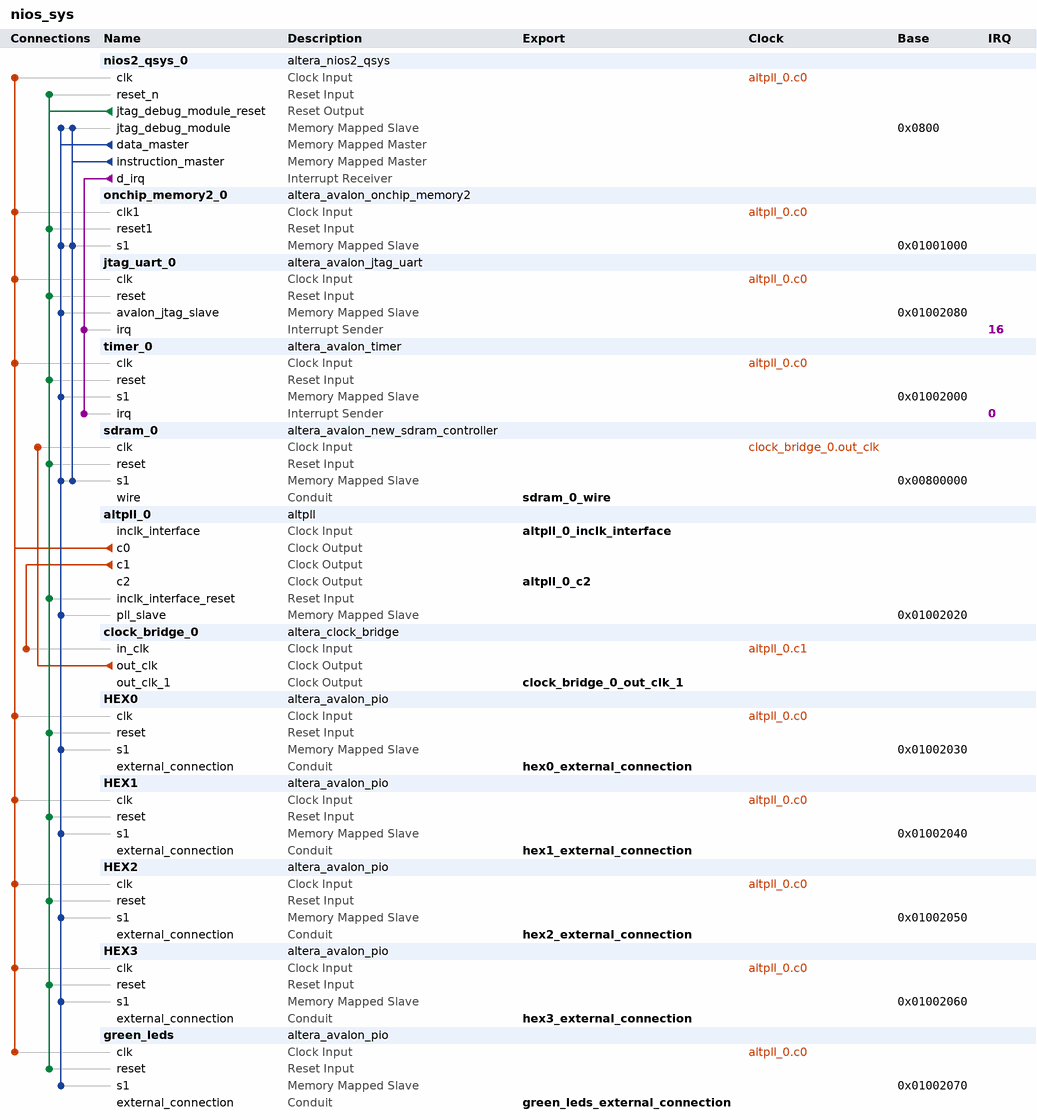
[diagram p0: system contents]
# Platform Designer (Qsys) system nios_sys, Cyclone II EP2C20F484C7
# Parameters at their usual value, and those the tool derives, are not listed.
package require -exact qsys 12.0
create_system nios_sys
set_project_property DEVICE_FAMILY {Cyclone II}
set_project_property DEVICE EP2C20F484C7

add_instance nios2_qsys_0 altera_nios2_qsys 12.0
set_instance_parameter_value nios2_qsys_0 resetSlave sdram_0.s1
set_instance_parameter_value nios2_qsys_0 exceptionSlave sdram_0.s1
set_instance_parameter_value nios2_qsys_0 breakSlave nios2_qsys_0.jtag_debug_module
set_instance_parameter_value nios2_qsys_0 impl Tiny
set_instance_parameter_value nios2_qsys_0 icache_size 4096

add_instance onchip_memory2_0 altera_avalon_onchip_memory2 12.0
set_instance_parameter_value onchip_memory2_0 dataWidth 32
set_instance_parameter_value onchip_memory2_0 dualPort false
set_instance_parameter_value onchip_memory2_0 initMemContent true
set_instance_parameter_value onchip_memory2_0 initializationFileName onchip_memory2_0
set_instance_parameter_value onchip_memory2_0 memorySize 4096

add_instance jtag_uart_0 altera_avalon_jtag_uart 12.0
set_instance_parameter_value jtag_uart_0 simInteractiveOptions INTERACTIVE_ASCII_OUTPUT

add_instance timer_0 altera_avalon_timer 12.0
set_instance_parameter_value timer_0 period 1
set_instance_parameter_value timer_0 periodUnits MSEC
set_instance_parameter_value timer_0 timerPreset CUSTOM

add_instance sdram_0 altera_avalon_new_sdram_controller 12.0
set_instance_parameter_value sdram_0 TAC 5.5
set_instance_parameter_value sdram_0 TRCD 20.0
set_instance_parameter_value sdram_0 TRP 20.0
set_instance_parameter_value sdram_0 casLatency 3
set_instance_parameter_value sdram_0 columnWidth 8
set_instance_parameter_value sdram_0 dataWidth 16
set_instance_parameter_value sdram_0 generateSimulationModel false
set_instance_parameter_value sdram_0 model custom
set_instance_parameter_value sdram_0 numberOfBanks 4
set_instance_parameter_value sdram_0 numberOfChipSelects 1
set_instance_parameter_value sdram_0 powerUpDelay 100.0
set_instance_parameter_value sdram_0 refreshPeriod 15.625
set_instance_parameter_value sdram_0 rowWidth 12

add_instance altpll_0 altpll 12.0
set_instance_parameter_value altpll_0 INCLK0_INPUT_FREQUENCY 20000
set_instance_parameter_value altpll_0 GATE_LOCK_SIGNAL YES
set_instance_parameter_value altpll_0 GATE_LOCK_COUNTER 25000
set_instance_parameter_value altpll_0 VALID_LOCK_MULTIPLIER 1
set_instance_parameter_value altpll_0 INVALID_LOCK_MULTIPLIER 5
set_instance_parameter_value altpll_0 CLK0_MULTIPLY_BY 1
set_instance_parameter_value altpll_0 CLK1_MULTIPLY_BY 1
set_instance_parameter_value altpll_0 CLK2_MULTIPLY_BY 1
set_instance_parameter_value altpll_0 CLK0_DIVIDE_BY 1
set_instance_parameter_value altpll_0 CLK1_DIVIDE_BY 1
set_instance_parameter_value altpll_0 CLK2_DIVIDE_BY 2
set_instance_parameter_value altpll_0 CLK1_PHASE_SHIFT -167
set_instance_parameter_value altpll_0 CLK2_PHASE_SHIFT 0
set_instance_parameter_value altpll_0 CLK1_DUTY_CYCLE 50
set_instance_parameter_value altpll_0 CLK2_DUTY_CYCLE 50
set_instance_parameter_value altpll_0 PORT_clk1 PORT_USED
set_instance_parameter_value altpll_0 PORT_clk2 PORT_USED
set_instance_parameter_value altpll_0 PORT_clk3 PORT_UNUSED
set_instance_parameter_value altpll_0 PORT_ARESET PORT_UNUSED
set_instance_parameter_value altpll_0 PORT_LOCKED PORT_USED

add_instance clock_bridge_0 altera_clock_bridge 12.0
set_instance_parameter_value clock_bridge_0 DERIVED_CLOCK_RATE 50000000
set_instance_parameter_value clock_bridge_0 EXPLICIT_CLOCK_RATE 50000000
set_instance_parameter_value clock_bridge_0 NUM_CLOCK_OUTPUTS 2

add_instance HEX0 altera_avalon_pio 12.0
set_instance_parameter_value HEX0 direction Output
set_instance_parameter_value HEX0 width 7

add_instance HEX1 altera_avalon_pio 12.0
set_instance_parameter_value HEX1 direction Output
set_instance_parameter_value HEX1 width 7

add_instance HEX2 altera_avalon_pio 12.0
set_instance_parameter_value HEX2 direction Output
set_instance_parameter_value HEX2 width 7

add_instance HEX3 altera_avalon_pio 12.0
set_instance_parameter_value HEX3 direction Output
set_instance_parameter_value HEX3 width 7

add_instance green_leds altera_avalon_pio 12.0
set_instance_parameter_value green_leds direction Output
set_instance_parameter_value green_leds width 8

# connections
add_connection altpll_0.c0 green_leds.clk clock
add_connection altpll_0.c0 HEX0.clk clock
add_connection altpll_0.c0 HEX1.clk clock
add_connection altpll_0.c0 HEX2.clk clock
add_connection altpll_0.c0 HEX3.clk clock
add_connection altpll_0.c0 jtag_uart_0.clk clock
add_connection altpll_0.c0 nios2_qsys_0.clk clock
add_connection altpll_0.c0 onchip_memory2_0.clk1 clock
add_connection altpll_0.c0 timer_0.clk clock
add_connection altpll_0.c1 clock_bridge_0.in_clk clock
add_connection clock_bridge_0.out_clk sdram_0.clk clock
add_connection nios2_qsys_0.jtag_debug_module_reset altpll_0.inclk_interface_reset reset
add_connection nios2_qsys_0.jtag_debug_module_reset green_leds.reset reset
add_connection nios2_qsys_0.jtag_debug_module_reset HEX0.reset reset
add_connection nios2_qsys_0.jtag_debug_module_reset HEX1.reset reset
add_connection nios2_qsys_0.jtag_debug_module_reset HEX2.reset reset
add_connection nios2_qsys_0.jtag_debug_module_reset HEX3.reset reset
add_connection nios2_qsys_0.jtag_debug_module_reset jtag_uart_0.reset reset
add_connection nios2_qsys_0.jtag_debug_module_reset nios2_qsys_0.reset_n reset
add_connection nios2_qsys_0.jtag_debug_module_reset onchip_memory2_0.reset1 reset
add_connection nios2_qsys_0.jtag_debug_module_reset sdram_0.reset reset
add_connection nios2_qsys_0.jtag_debug_module_reset timer_0.reset reset
add_connection nios2_qsys_0.data_master altpll_0.pll_slave avalon
set_connection_parameter_value nios2_qsys_0.data_master/altpll_0.pll_slave baseAddress 0x01002020
add_connection nios2_qsys_0.data_master green_leds.s1 avalon
set_connection_parameter_value nios2_qsys_0.data_master/green_leds.s1 baseAddress 0x01002070
add_connection nios2_qsys_0.data_master HEX0.s1 avalon
set_connection_parameter_value nios2_qsys_0.data_master/HEX0.s1 baseAddress 0x01002030
add_connection nios2_qsys_0.data_master HEX1.s1 avalon
set_connection_parameter_value nios2_qsys_0.data_master/HEX1.s1 baseAddress 0x01002040
add_connection nios2_qsys_0.data_master HEX2.s1 avalon
set_connection_parameter_value nios2_qsys_0.data_master/HEX2.s1 baseAddress 0x01002050
add_connection nios2_qsys_0.data_master HEX3.s1 avalon
set_connection_parameter_value nios2_qsys_0.data_master/HEX3.s1 baseAddress 0x01002060
add_connection nios2_qsys_0.data_master jtag_uart_0.avalon_jtag_slave avalon
set_connection_parameter_value nios2_qsys_0.data_master/jtag_uart_0.avalon_jtag_slave baseAddress 0x01002080
add_connection nios2_qsys_0.data_master nios2_qsys_0.jtag_debug_module avalon
set_connection_parameter_value nios2_qsys_0.data_master/nios2_qsys_0.jtag_debug_module baseAddress 0x0800
add_connection nios2_qsys_0.data_master onchip_memory2_0.s1 avalon
set_connection_parameter_value nios2_qsys_0.data_master/onchip_memory2_0.s1 baseAddress 0x01001000
add_connection nios2_qsys_0.data_master sdram_0.s1 avalon
set_connection_parameter_value nios2_qsys_0.data_master/sdram_0.s1 baseAddress 0x00800000
add_connection nios2_qsys_0.data_master timer_0.s1 avalon
set_connection_parameter_value nios2_qsys_0.data_master/timer_0.s1 baseAddress 0x01002000
add_connection nios2_qsys_0.instruction_master nios2_qsys_0.jtag_debug_module avalon
set_connection_parameter_value nios2_qsys_0.instruction_master/nios2_qsys_0.jtag_debug_module baseAddress 0x0800
add_connection nios2_qsys_0.instruction_master onchip_memory2_0.s1 avalon
set_connection_parameter_value nios2_qsys_0.instruction_master/onchip_memory2_0.s1 baseAddress 0x01001000
add_connection nios2_qsys_0.instruction_master sdram_0.s1 avalon
set_connection_parameter_value nios2_qsys_0.instruction_master/sdram_0.s1 baseAddress 0x00800000
add_connection nios2_qsys_0.d_irq jtag_uart_0.irq interrupt
set_connection_parameter_value nios2_qsys_0.d_irq/jtag_uart_0.irq irqNumber 16
add_connection nios2_qsys_0.d_irq timer_0.irq interrupt
set_connection_parameter_value nios2_qsys_0.d_irq/timer_0.irq irqNumber 0

# exported interfaces
add_interface hex3_external_connection conduit end
set_interface_property hex3_external_connection EXPORT_OF HEX3.external_connection
add_interface hex2_external_connection conduit end
set_interface_property hex2_external_connection EXPORT_OF HEX2.external_connection
add_interface hex1_external_connection conduit end
set_interface_property hex1_external_connection EXPORT_OF HEX1.external_connection
add_interface hex0_external_connection conduit end
set_interface_property hex0_external_connection EXPORT_OF HEX0.external_connection
add_interface sdram_0_wire conduit end
set_interface_property sdram_0_wire EXPORT_OF sdram_0.wire
add_interface altpll_0_inclk_interface clock sink
set_interface_property altpll_0_inclk_interface EXPORT_OF altpll_0.inclk_interface
add_interface altpll_0_c2 clock source
set_interface_property altpll_0_c2 EXPORT_OF altpll_0.c2
add_interface clock_bridge_0_out_clk_1 clock source
set_interface_property clock_bridge_0_out_clk_1 EXPORT_OF clock_bridge_0.out_clk_1
add_interface green_leds_external_connection conduit end
set_interface_property green_leds_external_connection EXPORT_OF green_leds.external_connection

save_system nios_sys.qsys
